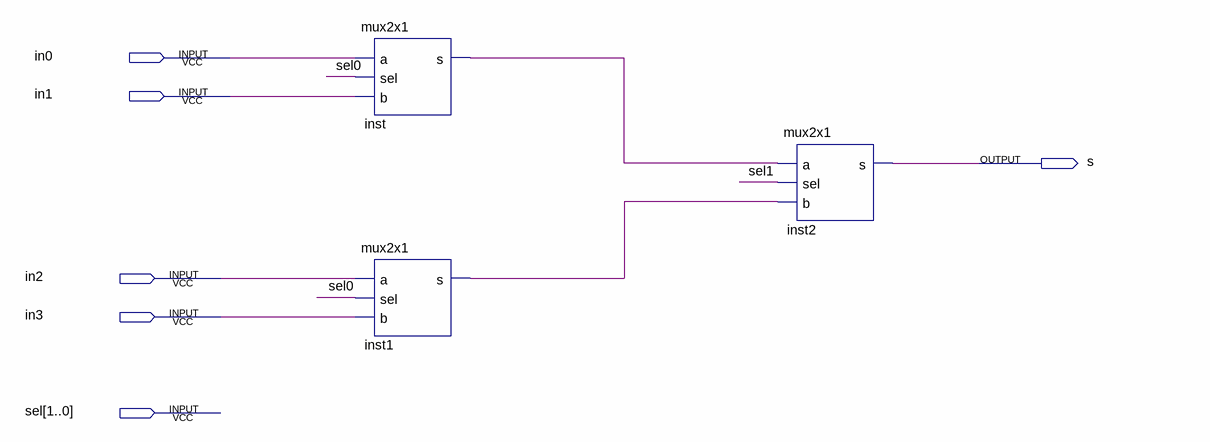
[diagram p0: schematic sheet]
// Quartus schematic mux4x1.bdf as structural Verilog: 3 symbols, 6 pins
module mux4x1 (
  input  in0,
  input  in1,
  input  in2,
  input  in3,
  input  [1:0] sel,
  output s
);

  wire inst1_s, inst_s;

  mux2x1 inst (.a(in0), .sel(sel[0]), .b(in1), .s(inst_s));
  mux2x1 inst1 (.a(in2), .sel(sel[0]), .b(in3), .s(inst1_s));
  mux2x1 inst2 (.a(inst_s), .sel(sel[1]), .b(inst1_s), .s(s));
endmodule
